# Altium schematic sheet PX4FMUv2.4.6_2.SchDoc
size 282 x 200 mm
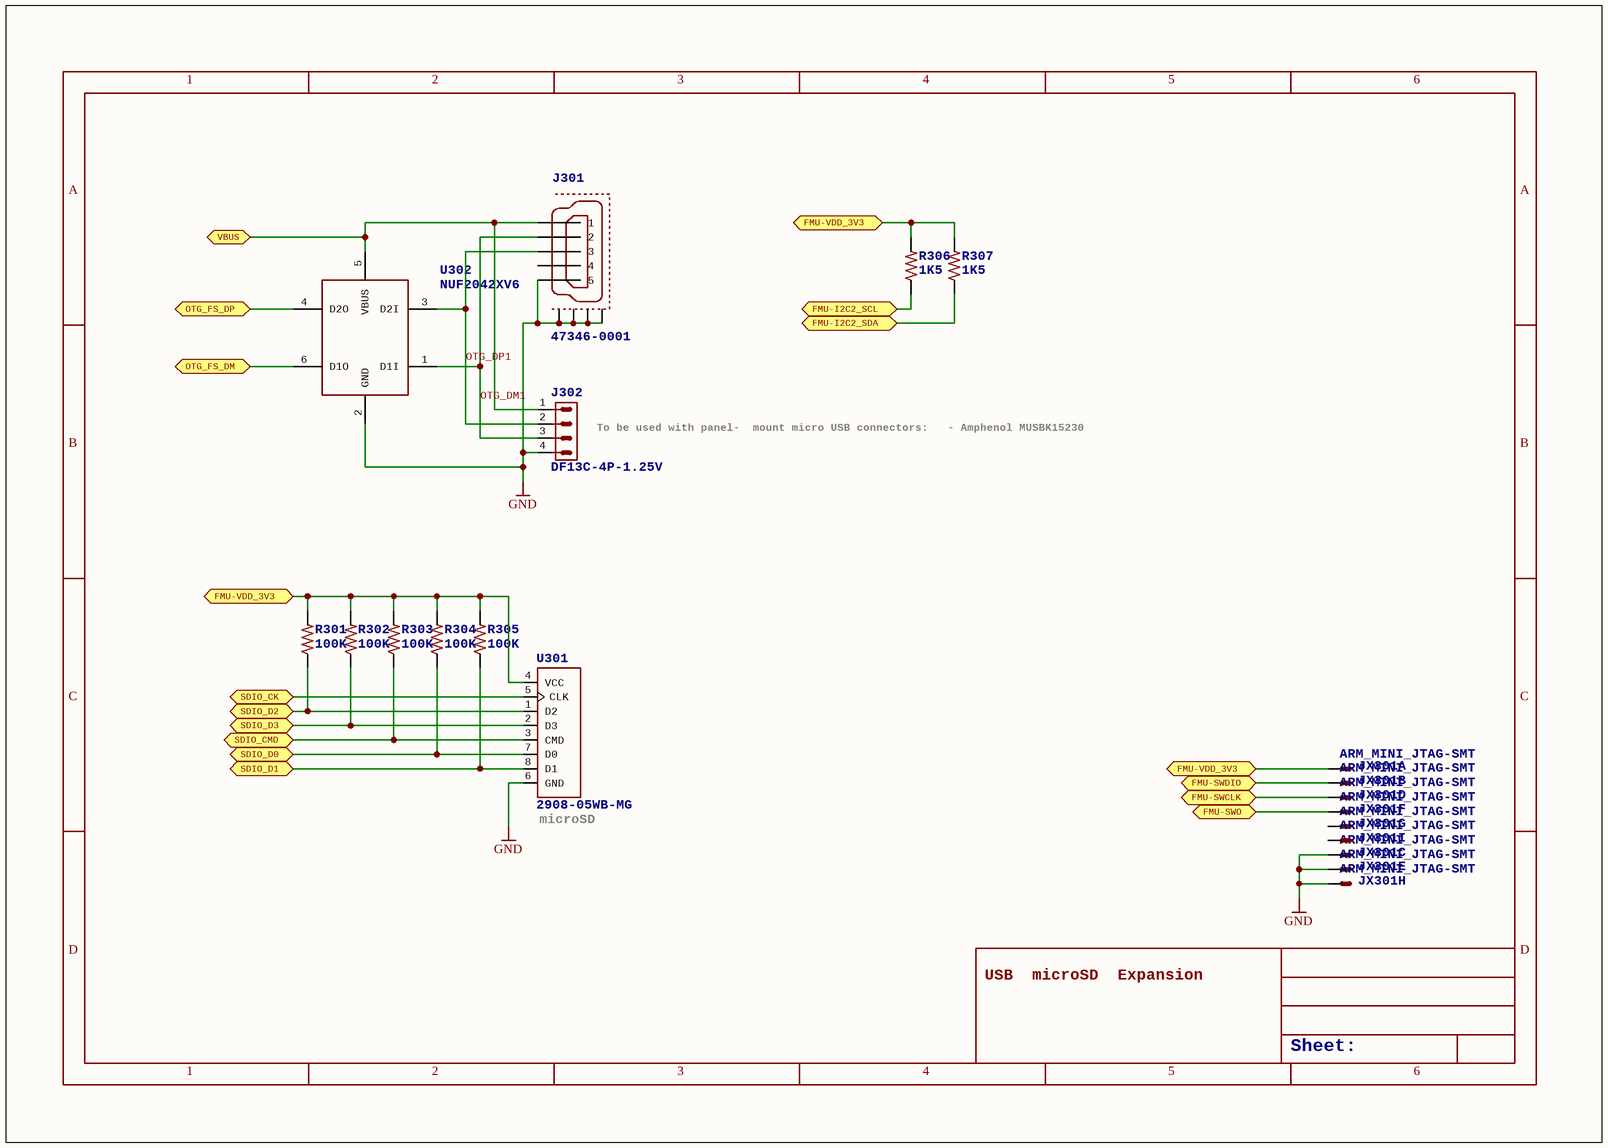
[diagram p0: PX4FMUv2.4.6_2.SchDoc]

## Parts
J301  47346-0001  [MOLEX-47346-0001]
J302  DF13C-4P-1.25V  [DF13C-4P-1.25V]
JX301  ARM_MINI_JTAG-SMT  [FTSH-105-01-XXX-DV-K]  (parts A,B,C,D,E,F,G,H,I of 9)
R301  100K  [0402-RES]
R302  100K  [0402-RES]
R303  100K  [0402-RES]
R304  100K  [0402-RES]
R305  100K  [0402-RES]
R306  1K5  [0402-RES]
R307  1K5  [0402-RES]
U301  2908-05WB-MG  [MICROSD]
U302  NUF2042XV6  [SOT563-6]

## Ports
FMU-I2C2_SCL, FMU-I2C2_SDA, FMU-SWCLK, FMU-SWDIO, FMU-SWO, FMU-VDD_3V3, OTG_FS_DM, OTG_FS_DP, SDIO_CK, SDIO_CMD, SDIO_D0, SDIO_D1, SDIO_D2, SDIO_D3, VBUS

## Nets
GND: J301.GND(5) J301.GND1 J301.GND2 J301.GND3 J301.GND4 J302.4 JX301.3(S) JX301.5(S) JX301.9(S) U301.6(GND) U302.2(GND)
FMU-I2C2_SCL: R306.P$1 ; port FMU-I2C2_SCL
FMU-I2C2_SDA: R307.P$1 ; port FMU-I2C2_SDA
FMU-SWCLK: JX301.4(S) ; port FMU-SWCLK
FMU-SWDIO: JX301.2(S) ; port FMU-SWDIO
FMU-SWO: JX301.6(S) ; port FMU-SWO
FMU-VDD_3V3: JX301.1(S) R301.P$2 R302.P$2 R303.P$2 R304.P$2 R305.P$2 R306.P$2 R307.P$2 U301.4(VCC) ; port FMU-VDD_3V3
OTG_DM1: J301.D-(2) J302.3 U302.1(D1I)
OTG_DP1: J301.D+(3) J302.2 U302.3(D2I)
OTG_FS_DM: U302.6(D1O) ; port OTG_FS_DM
OTG_FS_DP: U302.4(D2O) ; port OTG_FS_DP
SDIO_CK: U301.5(CLK) ; port SDIO_CK
SDIO_CMD: R303.P$1 U301.3(CMD) ; port SDIO_CMD
SDIO_D0: R304.P$1 U301.7(D0) ; port SDIO_D0
SDIO_D1: R305.P$1 U301.8(D1) ; port SDIO_D1
SDIO_D2: R301.P$1 U301.1(D2) ; port SDIO_D2
SDIO_D3: R302.P$1 U301.2(D3) ; port SDIO_D3
VBUS: J301.VBUS(1) J302.1 U302.5(VBUS) ; port VBUS

Not connected (* = marked no-connect by the designer): J301 ID(4); JX301 8(S) 10(S)

## Notes on the sheet
- (near J302) To be used with panel-
  mount micro USB connectors:
  - Amphenol MUSBK15230
- (near U301) microSD
- USB
  microSD
  Expansion
- Sheet:
- 1
- 2
- 3
- 4
- 5
- 6
- A
- B
- C
- D

## Library data of the parts
J301 = MOLEX-47346-0001: MICRO USB B, BOTTOM MOUNT
J302 = DF13-4P-1.25V: DF13-4P 1.25mm Pitch Miniature Crimping Connector.; PARTNO: DF13C-4P-1.25V(20)
JX301 = ARM_MINI_JTAG-SMT: CONNECTOR   wire to board 1.25 mm (.049 inch) pitch header; PARTNO: M50-3900542; BOM: EXCLUDE
R301-R305 = RESISTOR0402-RES: ResistorBasic schematic elements and footprints for 0603, 1206, and PTH 1/10th watt (small) resistors.; PARTNO: RC0402FR-07100KL
R306 R307 = RESISTOR0402-RES: ResistorBasic schematic elements and footprints for 0603, 1206, and PTH 1/10th watt (small) resistors.; PARTNO: RC0402FR-071K5L
U301 = MICROSDSDI: PARTNO: 2908-05WB-MG
U302 = NUF2042XV6: PARTNO: NUF2042XV6T1G